# EAGLE design board (EAGLE 9.2.2)
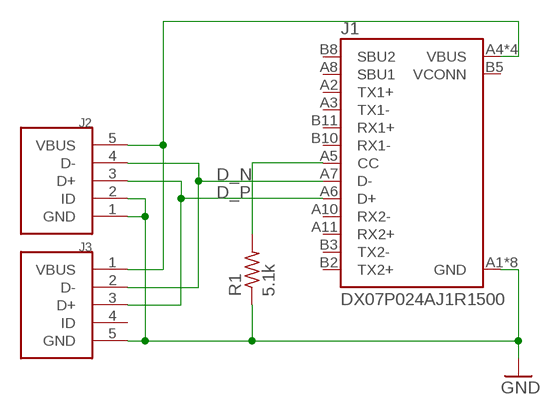
[diagram p0: schematic, sheet 1]

## Parts
J1  DX07P024AJ1R1500  [JAE_DX07P024AJ1R1500]
J2  USB59453-051110EDHLF  [59453-051110EDHLF]
J3  USBSEEK-USB  [SEEK-USB]
R1  5.1k  R-US_R0402  [R0402]

## Nets
D_N: J1.A7(D-) J2.4(D-) J3.2(D-)
D_P: J1.A6(D+) J2.3(D+) J3.3(D+)
GND: J1.A1(GND) J1.A12(GND) J1.B0(GND) J1.B1(GND) J1.B12(GND) J1.B13(GND) J1.B17(GND) J1.B18(GND) J2.1(GND) J2.2(ID) J3.5(GND) R1.1
N$4: J1.A5(CC) R1.2
VBUS: J1.A4(VBUS) J1.A9(VBUS) J1.B4(VBUS) J1.B9(VBUS) J2.5(VBUS) J3.1(VBUS)
Unconnected: J1.A2(TX1+) J1.A3(TX1-) J1.A8(SBU1) J1.A10(RX2-) J1.A11(RX2+) J1.B2(TX2+) J1.B3(TX2-) J1.B8(SBU2) J1.B10(RX1-) J1.B11(RX1+) J3.4(ID)

## Power pins joined to a net without a drawn wire
VCONN: J1.B5(VCONN)

## Library data of the parts
J1 = DX07P024AJ1R1500:DX07P024AJ1R1500: Cut Tape - Usb Type c Slim Plug; DESCRIPTION: Cut Tape - Usb Type c Slim Plug; DIGI-KEY_PART_NUMBER: 670-2868-1-ND; DIGI-KEY_PURCHASE_URL: https://www.digikey.com/product-detail/en/jae-electronics/DX07P024AJ1R1500/670-2868-1-ND/6003057?utm_source=snapeda&utm_medium=aggregator&utm_campaign=symbol; MF: JAE Electronics; MP: DX07P024AJ1R1500; PACKAGE: None
J2 J3 = DX07P024AJ1R1500:USB
R1 = rcl:R-US_: RESISTOR, American symbol; SPICEPREFIX: R

## Board
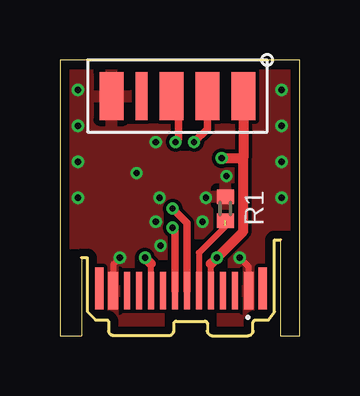
[diagram p1: board, top side]
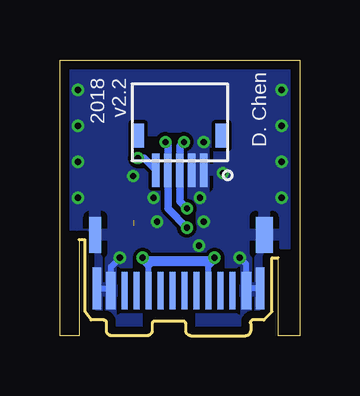
[diagram p2: board, bottom side, seen from below]

Size 10 x 11.5 mm. Coordinates in mm from the lower left corner, seen from the top.
Outline: 10,0 10,11.5 0,11.5 0,0 0.9,0 0.9,3.25 1.15,3.25 1.15,1 1.5,0.65 2,0.65 2.05,0.6 2.05,0.15 2.2,0 4.6,0 4.75,0.15 4.75,0.55 4.8,0.6 6.1,0.6 6.15,0.55 6.15,0.15 6.3,0 7.9,0 8.05,0.15 8.05,0.6 8.1,0.65 8.7,0.65 8.95,1 8.95,4 9.2,4 9.2,0 10,0
Copper layers (1*16): Top 0.035559375mm / dielectric 1.6mm / Bottom 0.035559375mm
Design rules "oshpark-2layer-tented": minimum track width 6mil, minimum drill 10mil, track to track 6mil, track to pad 6mil, pad to pad 6mil, via to via 6mil, smd to smd 6mil, copper to edge 15mil, drill to drill 6mil, minimum pad ring 5mil, minimum via ring 5mil, stop-mask expansion 2.5mil, vias tented up to drill 20mil, thermal gap 10mil

### Footprints (pad centres in the part's own frame; a part is rotated, then mirrored left to right if it is on the bottom)
JAE_DX07P024AJ1R1500 = smd 0.36 x 1.75: A0 3.405,1.975; A13 -3.405,1.975 | smd 0.41 x 1.55: A1 2.825,1.875; A12 -2.825,1.875 | smd 0.26 x 1.55: A2 2.25,1.875; A3 1.75,1.875; A4 1.25,1.875; A5 0.75,1.875; A6 0.25,1.875; A7 -0.25,1.875; A8 -0.75,1.875; A9 -1.25,1.875; A10 -1.75,1.875; A11 -2.25,1.875 | smd 0.36 x 1.75 bottom: B0 -3.405,1.975; B13 3.405,1.975 | smd 0.41 x 1.55 bottom: B1 -2.825,1.875; B12 2.825,1.875 | smd 0.26 x 1.55 bottom: B2 -2.25,1.875; B3 -1.75,1.875; B4 -1.25,1.875; B5 -0.75,1.875; B6 -0.25,1.875; B7 0.25,1.875; B8 0.75,1.875; B9 1.25,1.875; B10 1.75,1.875; B11 2.25,1.875 | smd 0.7 x 1.5 bottom: B17 -3.575,4.2 | smd 0.5 x 1.5 bottom: B18 3.475,4.2
59453-051110EDHLF = smd 0.3 x 1.4: 1 1,3.6; 2 1.5,3.6; 3 2,3.6; 4 2.5,3.6; 5 3,3.6 | smd 0.52 x 1: NC1 0.26,2.15; NC2 3.74,2.15
SEEK-USB = smd 1 x 2: 1 6,1; 2 4.5,1; 3 3,1; 5 0.5,1 | smd 0.5 x 2: 4 1.75,1
R0402 = smd 0.6 x 0.7: 1 -0.5,0; 2 0.5,0

### Placement (x,y rotation side)
J1  5.05,0 0 top
J2  3,10.5 180 bottom
J3  1.65,9 0 top
R1  6.9,5.3 270 top

### Tracks (layer width: path | path; a pad name or v marks a point on that pad's centre or on a via)
D_N  (via drill 0.25)
  Top 0.305: J1.A7 4.8,4.4 v4.7,4.5 | v5.6,8.07 6.15,8.62 J3.2
  Bottom 0.305: v4.7,4.5 5.5,5.3 J2.4 5.5,7.97 v5.6,8.07
D_P  (via drill 0.25)
  Top 0.305: v4.7,5.3 5.3,4.7 J1.A6 | J3.3 4.95,9.7 4.95,8.2 v4.83,8.07
  Bottom 0.305: v4.7,5.3 5,5.6 J2.3 5,7.9 v4.83,8.07
GND  (via drill 0.25)
  Top 0.254: J1.B12 7.88,2.88 v7.5,3.25 | v2.5,3.25 2.23,2.98 J1.B1
  Bottom 0.254: v2.5,3.25 2.23,2.98 J1.B1 2.12,1.98 J1.B0 | v7.5,3.25 7.88,2.88 J1.B12 7.97,1.98 J1.B13
  other vias: 4.15,5.75 3.2,6.78 9.25,10.25 0.75,10.25 4,4.75 4.2,3.75 0.75,5.75 9.25,7.25 0.75,8.75 9.25,8.75 9.25,5.75 0.75,7.25 5.95,4.75 6.95,6.65 6.1,5.75 4,8.07
  pour Top: 0,0 10,0 10,11.5 0,11.5
  pour Bottom: 0,0 10,0 10,11.5 0,11.5
N$4  (1 unrouted)
  Top 0.254: J1.A5 5.8,3.45 6.9,4.55 6.9,4.6
VBUS  (via drill 0.25)
  Top 0.254: J1.B4 3.8,3 | J1.A4 6.3,3
  Top 0.406: 3.8,3 v3.55,3.25 | 6.3,3 v6.55,3.25 7.65,4.35 7.65,7.4 | v6.75,7.4 7.65,7.4 | J3.1 7.65,7.4
  Bottom 0.254: J1.B4 3.8,3 | J1.A4 6.3,3
  Bottom 0.305: J2.5 6.5,7.4 v6.75,7.4
  Bottom 0.406: 3.8,3 3.7,3.1 | 3.7,3.1 v3.55,3.25 | 3.7,3.1 6.4,3.1 | v6.55,3.25 6.4,3.1 | 6.4,3.1 6.3,3

### Text on the board
bPlace: D. Chen | v2.2 | 2018